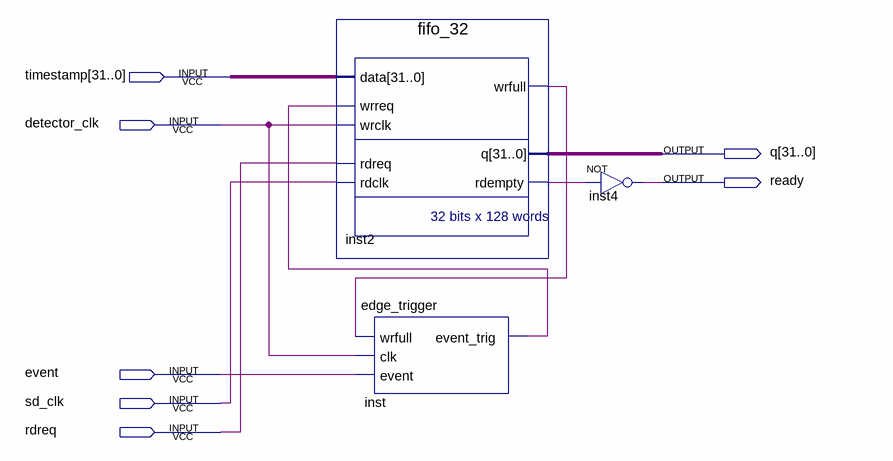
[diagram p0: schematic sheet]
// Quartus schematic memory.bdf as structural Verilog: 3 symbols, 7 pins
module memory (
  input  [31:0] timestamp,
  input  detector_clk,
  input  \event ,
  input  sd_clk,
  input  rdreq,
  output [31:0] q,
  output ready
);

  wire inst2_rdempty, inst2_wrfull, inst_event_trig;

  fifo_32 inst2 (
    .data(timestamp), .wrreq(inst_event_trig), .wrclk(detector_clk), .rdreq(rdreq), .rdclk(sd_clk),
    .wrfull(inst2_wrfull), .q(q), .rdempty(inst2_rdempty));
  edge_trigger inst (.wrfull(inst2_wrfull), .clk(detector_clk), .\event (\event ), .event_trig(inst_event_trig));
  not inst4 (ready, inst2_rdempty);
endmodule
